# EAGLE design BPMLabMainDriver (EAGLE 7.5.0)
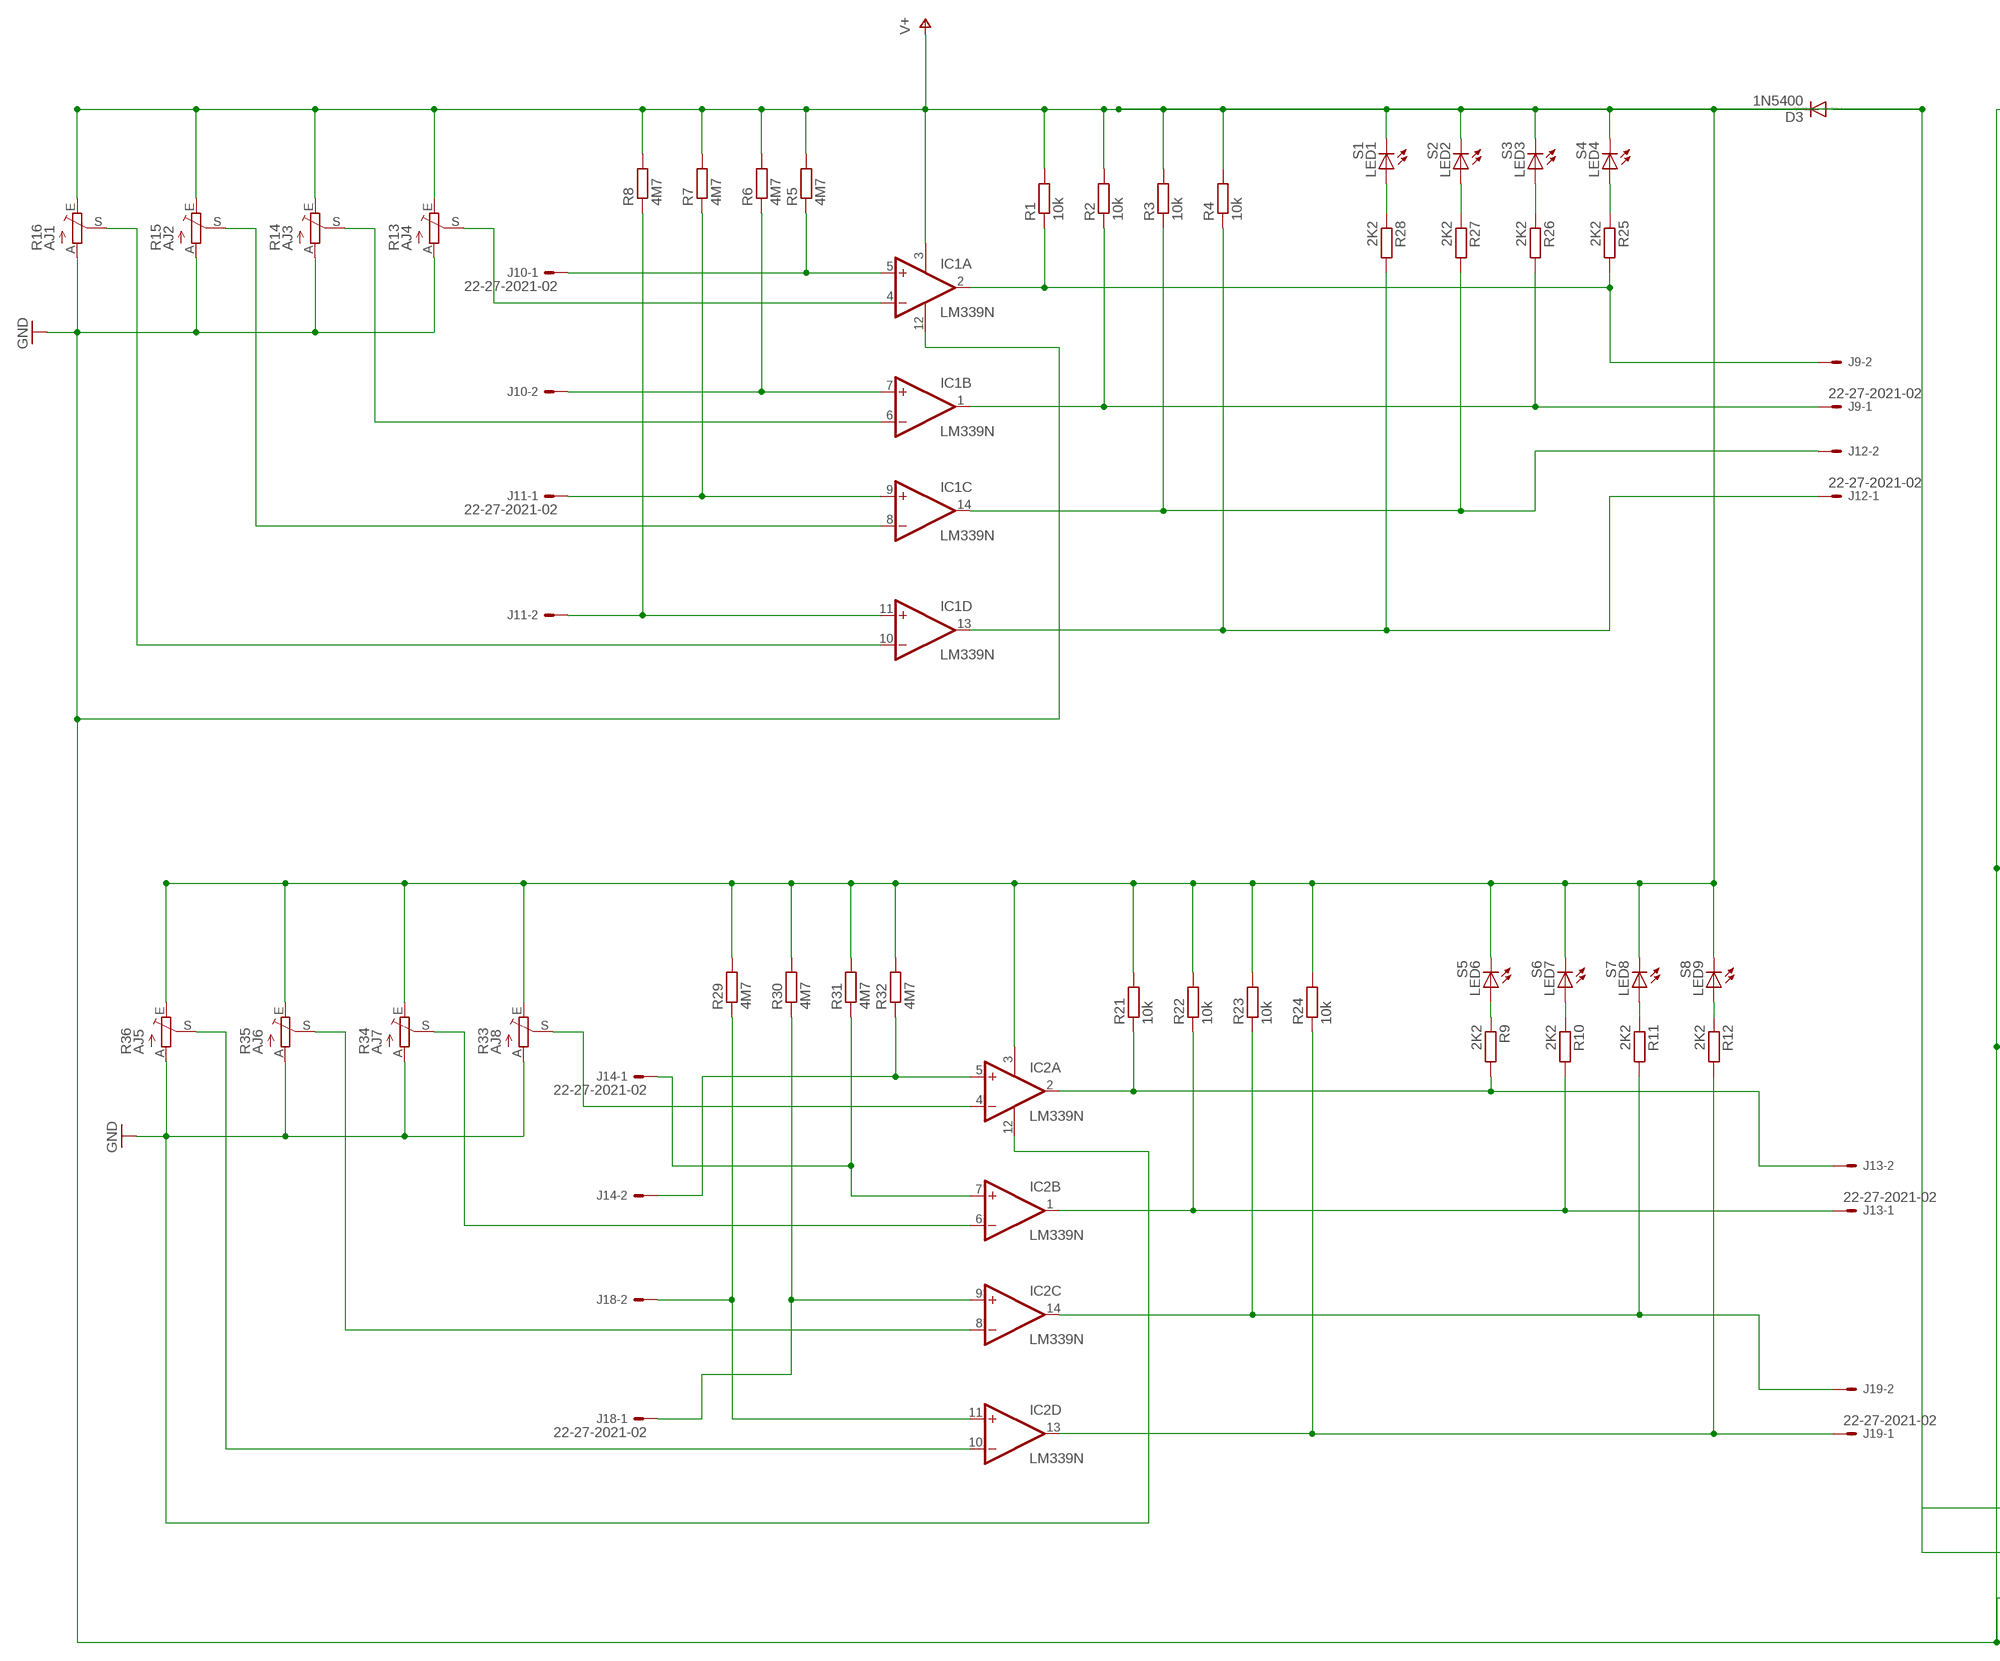
[diagram p0: schematic, sheet 1, part 1 of 2]
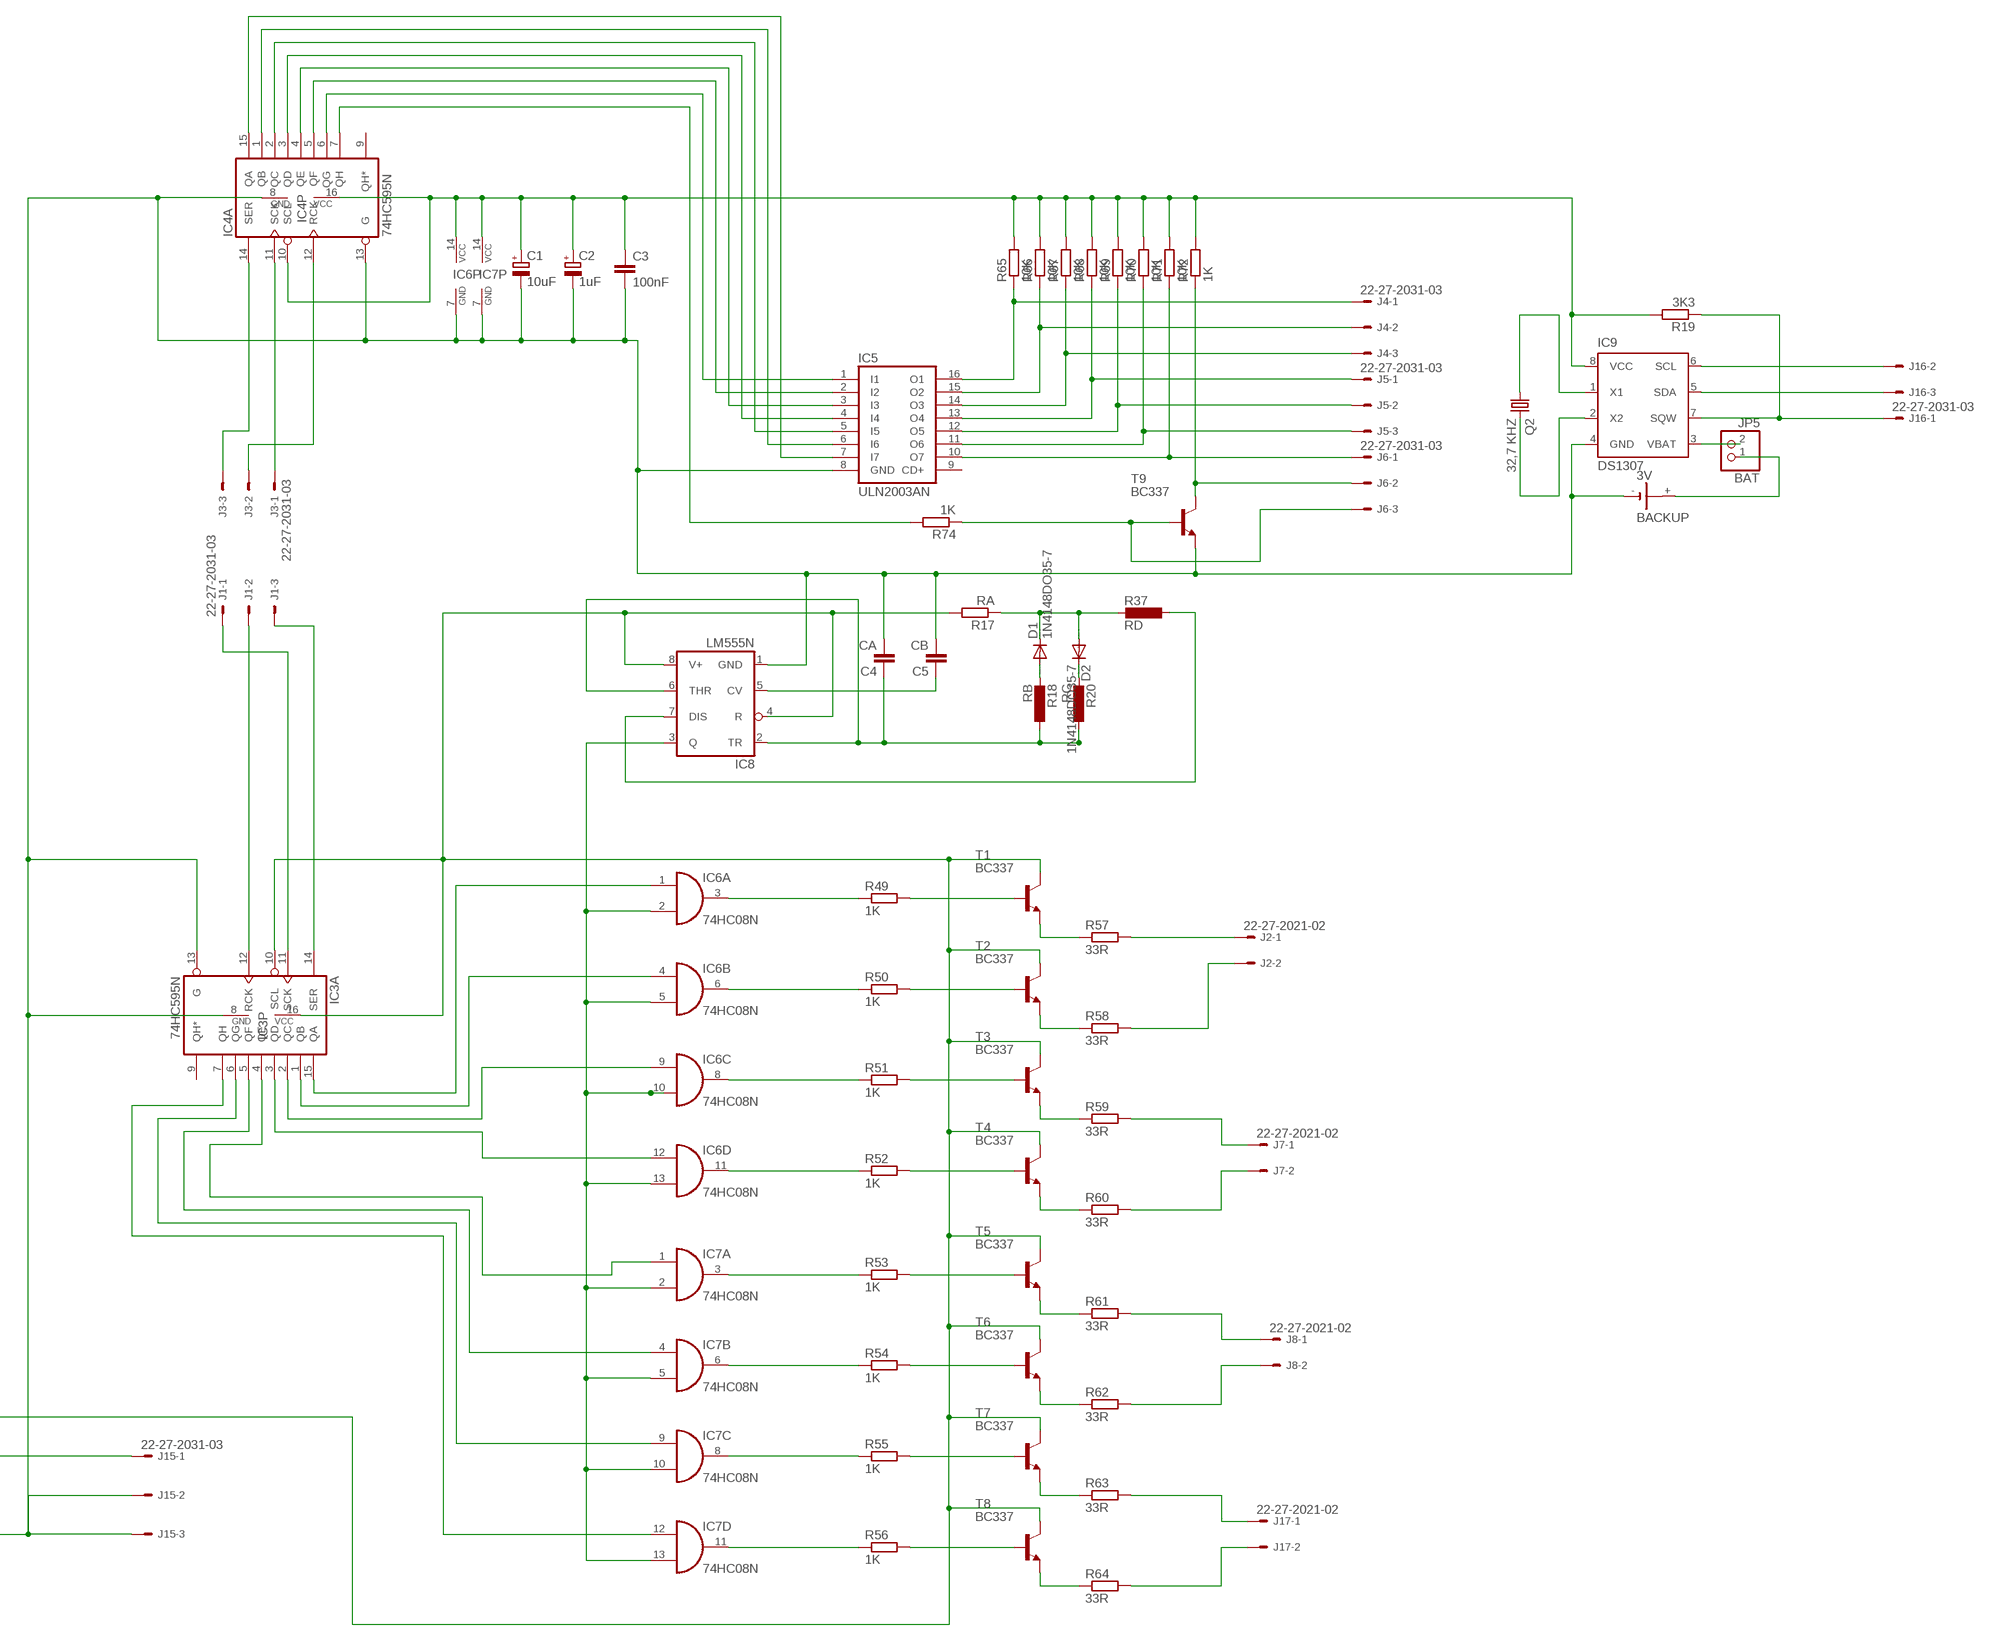
[diagram p1: schematic, sheet 1, part 2 of 2]

## Parts
3V  BACKUP  CR2032V  [CR2032V]
BAT  JP5  PINHD-1X2  [1X02]
C1  10uF  CPOL-EUE2.5-6  [E2,5-6]
C2  1uF  CPOL-EUE2.5-6  [E2,5-6]
C3  100nF  C-EU050-024X044  [C050-024X044]
C4  CA  C-EU050-025X075  [C050-025X075]
C5  CB  C-EU050-024X044  [C050-024X044]
D1  1N4148DO35-7  [DO35-7]
D2  1N4148DO35-7  [DO35-7]
D3  1N5400  [DO201-15]
IC1  LM339N  [DIL14]
IC2  LM339N  [DIL14]
IC3  74HC595N  [DIL16]
IC4  74HC595N  [DIL16]
IC5  ULN2003AN  [DIL16]
IC6  74HC08N  [DIL14]
IC7  74HC08N  [DIL14]
IC8  LM555N  [DIL08]
IC9  DS1307  [DIL08]
J1  22-27-2031-03  [6410-03]
J2  22-27-2021-02  [6410-02]
J3  22-27-2031-03  [6410-03]
J4  22-27-2031-03  [6410-03]
J5  22-27-2031-03  [6410-03]
J6  22-27-2031-03  [6410-03]
J7  22-27-2021-02  [6410-02]
J8  22-27-2021-02  [6410-02]
J9  22-27-2021-02  [6410-02]
J10  22-27-2021-02  [6410-02]
J11  22-27-2021-02  [6410-02]
J12  22-27-2021-02  [6410-02]
J13  22-27-2021-02  [6410-02]
J14  22-27-2021-02  [6410-02]
J15  22-27-2031-03  [6410-03]
J16  22-27-2031-03  [6410-03]
J17  22-27-2021-02  [6410-02]
J18  22-27-2021-02  [6410-02]
J19  22-27-2021-02  [6410-02]
LED1  S1  LED5MM  [LED5MM]
LED2  S2  LED5MM  [LED5MM]
LED3  S3  LED5MM  [LED5MM]
LED4  S4  LED5MM  [LED5MM]
LED6  S5  LED5MM  [LED5MM]
LED7  S6  LED5MM  [LED5MM]
LED8  S7  LED5MM  [LED5MM]
LED9  S8  LED5MM  [LED5MM]
Q2  32,7 KHZ  CRYSTALTC38H  [TC38H]
R1  10k  R-EU_0207/7  [0207/7]
R2  10k  R-EU_0207/7  [0207/7]
R3  10k  R-EU_0207/7  [0207/7]
R4  10k  R-EU_0207/7  [0207/7]
R5  4M7  R-EU_0207/10  [0207/10]
R6  4M7  R-EU_0207/10  [0207/10]
R7  4M7  R-EU_0207/10  [0207/10]
R8  4M7  R-EU_0207/10  [0207/10]
R9  2K2  R-EU_0207/7  [0207/7]
R10  2K2  R-EU_0207/7  [0207/7]
R11  2K2  R-EU_0207/7  [0207/7]
R12  2K2  R-EU_0207/7  [0207/7]
R13  AJ4  TRIM_EU-RS3  [RS3]
R14  AJ3  TRIM_EU-RS3  [RS3]
R15  AJ2  TRIM_EU-RS3  [RS3]
R16  AJ1  TRIM_EU-RS3  [RS3]
R17  RA  R-EU_0207/10  [0207/10]
R18  RB  L-EU0207/12  [0207/12]
R19  3K3  R-EU_0207/10  [0207/10]
R20  RC  L-EU0207/12  [0207/12]
R21  10k  R-EU_0207/7  [0207/7]
R22  10k  R-EU_0207/7  [0207/7]
R23  10k  R-EU_0207/7  [0207/7]
R24  10k  R-EU_0207/7  [0207/7]
R25  2K2  R-EU_0207/7  [0207/7]
R26  2K2  R-EU_0207/7  [0207/7]
R27  2K2  R-EU_0207/7  [0207/7]
R28  2K2  R-EU_0207/7  [0207/7]
R29  4M7  R-EU_0207/7  [0207/7]
R30  4M7  R-EU_0207/10  [0207/10]
R31  4M7  R-EU_0207/10  [0207/10]
R32  4M7  R-EU_0207/10  [0207/10]
R33  AJ8  TRIM_EU-RS3  [RS3]
R34  AJ7  TRIM_EU-RS3  [RS3]
R35  AJ6  TRIM_EU-RS3  [RS3]
R36  AJ5  TRIM_EU-RS3  [RS3]
R37  RD  L-EU0207/12  [0207/12]
R49  1K  R-EU_0207/10  [0207/10]
R50  1K  R-EU_0207/10  [0207/10]
R51  1K  R-EU_0207/10  [0207/10]
R52  1K  R-EU_0207/10  [0207/10]
R53  1K  R-EU_0207/10  [0207/10]
R54  1K  R-EU_0207/10  [0207/10]
R55  1K  R-EU_0207/10  [0207/10]
R56  1K  R-EU_0207/12  [0207/12]
R57  33R  R-EU_0207/10  [0207/10]
R58  33R  R-EU_0207/10  [0207/10]
R59  33R  R-EU_0207/10  [0207/10]
R60  33R  R-EU_0207/10  [0207/10]
R61  33R  R-EU_0207/10  [0207/10]
R62  33R  R-EU_0207/10  [0207/10]
R63  33R  R-EU_0207/10  [0207/10]
R64  33R  R-EU_0207/10  [0207/10]
R65  10K  R-EU_0207/10  [0207/10]
R66  10K  R-EU_0207/10  [0207/10]
R67  10K  R-EU_0207/10  [0207/10]
R68  10K  R-EU_0207/10  [0207/10]
R69  10K  R-EU_0207/10  [0207/10]
R70  10K  R-EU_0207/10  [0207/10]
R71  10K  R-EU_0207/10  [0207/10]
R72  1K  R-EU_0207/10  [0207/10]
R74  1K  R-EU_0207/10  [0207/10]
T1  BC337  [TO92]
T2  BC337  [TO92]
T3  BC337  [TO92]
T4  BC337  [TO92]
T5  BC337  [TO92]
T6  BC337  [TO92]
T7  BC337  [TO92]
T8  BC337  [TO92]
T9  BC337  [TO92]

## Nets
GND: 3V.- C1.- C2.- C3.2 C4.2 C5.2 IC1.12(P:GND) IC2.12(P:GND) IC3.8(P:GND) IC3.13(A:G) IC4.8(P:GND) IC4.13(A:G) IC5.8(GND) IC6.7(P:GND) IC7.7(P:GND) IC8.1(GND) IC9.4(GND) J15.2 J15.3 R13.A R14.A R15.A R16.A R33.A R34.A R35.A R36.A T9.1(E)
N$1: IC1.2(A:OUT) J9.2 R1.1 R25.2
N$2: IC1.1(B:OUT) J9.1 R2.1 R26.2
N$3: IC1.14(C:OUT) J12.2 R3.1 R27.2
N$4: IC1.13(D:OUT) J12.1 R4.1 R28.2
N$5: IC1.5(A:+IN) J10.1 R5.1
N$6: IC1.7(B:+IN) J10.2 R6.1
N$7: IC1.9(C:+IN) J11.1 R7.1
N$8: IC1.11(D:+IN) J11.2 R8.1
N$9: IC5.16(O1) J4.1 R65.1
N$10: IC1.10(D:-IN) R16.S
N$11: IC1.8(C:-IN) R15.S
N$12: IC1.4(A:-IN) R13.S
N$13: IC1.6(B:-IN) R14.S
N$14: IC6.2(A:I1) IC6.5(B:I1) IC6.10(C:I1) IC6.13(D:I1) IC7.2(A:I1) IC7.5(B:I1) IC7.10(C:I1) IC7.13(D:I1) IC8.3(Q)
N$15: D1.A R18.2
N$16: D2.C R20.2
N$17: LED6.A R9.1
N$18: LED7.A R10.1
N$19: LED8.A R11.1
N$20: LED9.A R12.1
N$21: IC3.1(A:QB) IC6.4(B:I0)
N$22: D1.C D2.A R17.1 R37.2
N$23: C5.1 IC8.5(CV)
N$24: IC8.7(DIS) R37.1
N$25: IC2.2(A:OUT) J13.2 R9.2 R21.1
N$26: 3V.+ BAT.1
N$27: IC2.1(B:OUT) J13.1 R10.2 R22.1
N$28: LED1.A R28.1
N$29: LED2.A R27.1
N$30: LED3.A R26.1
N$31: LED4.A R25.1
N$32: IC2.14(C:OUT) J19.2 R11.2 R23.1
N$33: IC2.13(D:OUT) J19.1 R12.2 R24.1
N$34: IC2.10(D:-IN) R36.S
N$35: IC2.8(C:-IN) R35.S
N$36: IC2.4(A:-IN) R33.S
N$37: IC2.6(B:-IN) R34.S
N$38: IC2.5(A:+IN) J14.2 R32.1
N$39: IC2.7(B:+IN) J14.1 R31.1
N$40: IC2.9(C:+IN) J18.1 R30.1
N$41: IC2.11(D:+IN) J18.2 R29.1
N$42: IC9.6(SCL) J16.2
N$43: IC9.5(SDA) J16.3
N$44: IC3.2(A:QC) IC6.9(C:I0)
N$45: IC3.3(A:QD) IC6.12(D:I0)
N$46: IC3.4(A:QE) IC7.1(A:I0)
N$47: IC3.5(A:QF) IC7.4(B:I0)
N$48: IC3.6(A:QG) IC7.9(C:I0)
N$49: IC3.7(A:QH) IC7.12(D:I0)
N$50: IC6.3(A:O) R49.1
N$51: IC6.6(B:O) R50.1
N$52: IC6.8(C:O) R51.1
N$53: IC3.15(A:QA) IC6.1(A:I0)
N$54: IC6.11(D:O) R52.1
N$55: IC7.3(A:O) R53.1
N$56: IC7.6(B:O) R54.1
N$57: IC7.8(C:O) R55.1
N$58: IC7.11(D:O) R56.1
N$59: C4.1 IC8.2(TR) IC8.6(THR) R18.1 R20.1
N$60: J17.2 R64.2
N$61: R49.2 T1.2(B)
N$62: R50.2 T2.2(B)
N$63: R51.2 T3.2(B)
N$64: R52.2 T4.2(B)
N$65: R53.2 T5.2(B)
N$66: R54.2 T6.2(B)
N$67: R56.2 T8.2(B)
N$68: R55.2 T7.2(B)
N$69: R57.1 T1.1(E)
N$70: R58.1 T2.1(E)
N$71: R59.1 T3.1(E)
N$72: R60.1 T4.1(E)
N$73: R61.1 T5.1(E)
N$74: R62.1 T6.1(E)
N$75: R63.1 T7.1(E)
N$76: R64.1 T8.1(E)
N$77: J8.1 R61.2
N$78: IC3.11(A:SCK) J1.1
N$79: IC3.12(A:RCK) J1.2
N$80: IC3.14(A:SER) J1.3
N$81: J8.2 R62.2
N$82: J17.1 R63.2
N$83: J7.2 R60.2
N$84: J7.1 R59.2
N$85: J2.2 R58.2
N$86: J2.1 R57.2
N$88: IC4.15(A:QA) IC5.7(I7)
N$89: IC4.1(A:QB) IC5.6(I6)
N$90: IC4.2(A:QC) IC5.5(I5)
N$91: IC4.3(A:QD) IC5.4(I4)
N$92: IC4.4(A:QE) IC5.3(I3)
N$93: IC4.5(A:QF) IC5.2(I2)
N$94: IC4.6(A:QG) IC5.1(I1)
N$95: IC5.15(O2) J4.2 R66.1
N$96: IC5.14(O3) J4.3 R67.1
N$97: IC4.11(A:SCK) J3.1
N$98: IC4.12(A:RCK) J3.2
N$99: IC4.14(A:SER) J3.3
N$100: IC5.13(O4) J5.1 R68.1
N$101: D3.A J15.1
N$102: IC5.12(O5) J5.2 R69.1
N$103: IC5.11(O6) J5.3 R70.1
N$104: IC5.10(O7) J6.1 R71.1
N$105: J6.2 R72.1 T9.3(C)
N$106: J6.3 R74.1 T9.2(B)
N$107: IC4.7(A:QH) R74.2
N$108: IC9.7(SQW) J16.1 R19.1
N$109: IC9.1(X1) Q2.1
N$110: IC9.2(X2) Q2.2
N$111: BAT.2 IC9.3(VBAT)
VCC: C1.+ C2.+ C3.1 D3.C IC1.3(P:V+) IC2.3(P:V+) IC3.10(A:SCL) IC3.16(P:VCC) IC4.10(A:SCL) IC4.16(P:VCC) IC6.14(P:VCC) IC7.14(P:VCC) IC8.4(R) IC8.8(V+) IC9.8(VCC) LED1.K(C) LED2.K(C) LED3.K(C) LED4.K(C) LED6.K(C) LED7.K(C) LED8.K(C) LED9.K(C) R1.2 R2.2 R3.2 R4.2 R5.2 R6.2 R7.2 R8.2 R13.E R14.E R15.E R16.E R17.2 R19.2 R21.2 R22.2 R23.2 R24.2 R29.2 R30.2 R31.2 R32.2 R33.E R34.E R35.E R36.E R65.2 R66.2 R67.2 R68.2 R69.2 R70.2 R71.2 R72.2 T1.3(C) T2.3(C) T3.3(C) T4.3(C) T5.3(C) T6.3(C) T7.3(C) T8.3(C) ; supply symbol labelled V+
Unconnected: 3V.+@1(+) IC3.9(A:QH*) IC4.9(A:QH*) IC5.9(CD+)

## Library data of the parts
3V = battery:CR2032V: LI BATTERY Varta
BAT = pinhead:PINHD-1X2: PIN HEADER
C1 C2 = rcl:CPOL-EU: POLARIZED CAPACITOR, European symbol
C3-C5 = resistor:C-EU: CAPACITOR, European symbol
D1 D2 = diode:1N4148: DIODE high speed (Philips)
D3 = diode:1N5400: DIODE standard rectifier, 3 A, 50 V (Motorola)
IC1 IC2 = linear:LM339: Low Power Low Offset Voltage Quad Comparators with open collector; LM139/LM239/LM339/LM2901/LM3302
IC3 IC4 = 74xx-eu:74*595: 8-bit SHIFT REGISTER, output latch
IC5 = uln-udn:ULN2003A: DRIVER ARRAY
IC6 IC7 = 74xx-eu:74*08: Quad 2-input AND gate
IC8 = linear:*555: TIMER
IC9 = ds1307_pcf8583:DS1307: I2C-Bus CLOCK/CALENDAR
J1 J3-J6 J15 J16 = con-molex:22-?-03: CONNECTOR wire to board 2.54 mm (.1 inch) pitch header; OC_FARNELL: unknown; OC_NEWARK: unknown
J2 J7-J14 J17-J19 = con-molex:22-?-02: CONNECTOR wire to board 2.54 mm (.1 inch) pitch header; OC_FARNELL: unknown; OC_NEWARK: unknown
LED1-LED4 LED6-LED9 = led:LED: LED OSRAM: - CHIPLED LG R971, LG N971, LY N971, LG Q971, LY Q971, LO R971, LY R971 LH N974, LH R974 LS Q976, LO Q976, LY Q976 LO Q996 - Hyper CHIPLED LW Q18S LB Q993, LB Q99A, LB R99A - SideLED LS A670, LO A670, LY A670, LG A670, LP A670 LB A673, LV A673, LT A673, LW A673 LH A674 LY A675 LS A676, LA A676, LO A676, LY A676, LW A676 LS A679, LY A679, LG A679 - Hyper Micro SIDELED® LS Y876, LA Y876, LO Y876, LY Y876 LT Y87S - SmartLED LW L88C, LW L88S LB L89C, LB L89S, LG L890 LS L89K, LO L89K, LY L89K LS L896, LA L896, LO L896, LY L896 - TOPLED LS T670, LO T670, LY T670, LG T670, LP T670 LSG T670, LSP T670, LSY T670, LOP T670, LYG T670 LG T671, LOG T671, LSG T671 LB T673, LV T673, LT T673, LW T673 LH T674 LS T676, LA T676, LO T676, LY T676, LB T676, LH T676, LSB T676, LW T676 LB T67C, LV T67C, LT T67C, LS T67K, LO T67K, LY T67K, LW E67C LS E67B, LA E67B, LO E67B, LY E67B, LB E67C, LV E67C, LT E67C LW T67C LS T679, LY T679, LG T679 LS T770, LO T770, LY T770, LG T770, LP T770 LB T773, LV T773, LT T773, LW T773 LH T774 LS E675, LA E675, LY E675, LS T675 LS T776, LA T776, LO T776, LY T776, LB T776 LHGB T686 LT T68C, LB T68C - Hyper Mini TOPLED® LB M676 - Mini TOPLED Santana® LG M470 LS M47K, LO M47K, LY M47K Source: http://www.osram.convergy.de LUXEON: - LUMILED® LXK2-PW12-R00, LXK2-PW12-S00, LXK2-PW14-U00, LXK2-PW14-V00 LXK2-PM12-R00, LXK2-PM12-S00, LXK2-PM14-U00 LXK2-PE12-Q00, LXK2-PE12-R00, LXK2-PE12-S00, LXK2-PE14-T00, LXK2-PE14-U00 LXK2-PB12-K00, LXK2-PB12-L00, LXK2-PB12-M00, LXK2-PB14-N00, LXK2-PB14-P00, LXK2-PB14-Q00 LXK2-PR12-L00, LXK2-PR12-M00, LXK2-PR14-Q00, LXK2-PR14-R00 LXK2-PD12-Q00, LXK2-PD12-R00, LXK2-PD12-S00 LXK2-PH12-R00, LXK2-PH12-S00 LXK2-PL12-P00, LXK2-PL12-Q00, LXK2-PL12-R00 Source: www.luxeon.com KINGBRIGHT: KA-3528ASYC Source: www.kingbright.com
Q2 = crystal:CRYSTAL: CRYSTAL; OC_FARNELL: unknown; OC_NEWARK: unknown
R1-R12 R17 R19 R21-R32 R49-R72 R74 = resistor:R-EU_: RESISTOR, European symbol
R13-R16 R33-R36 = pot:TRIM_EU-: POTENTIOMETER
R18 R20 R37 = resistor:L-EU: INDUCTOR, European symbol
T1-T9 = transistor:BC337: NPN TRANSISTOR

## Board
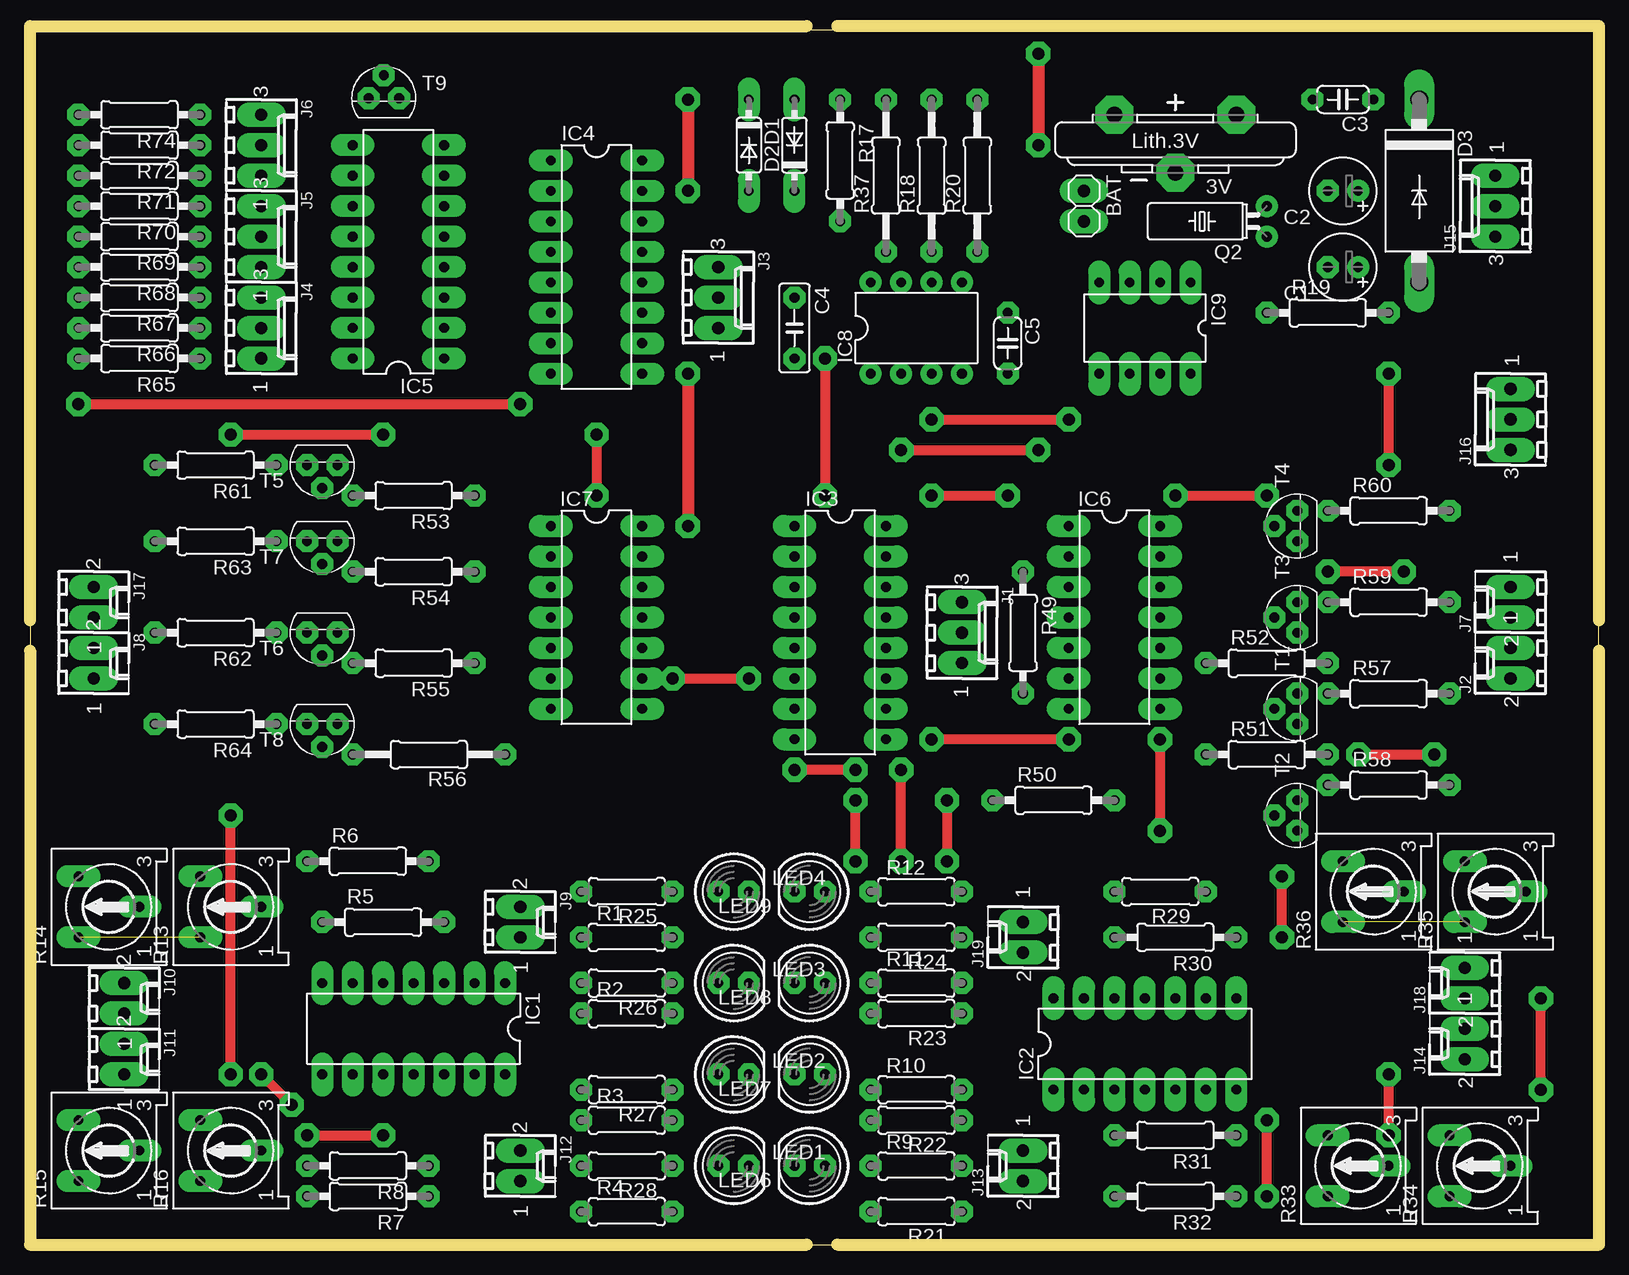
[diagram p2: board, top side]
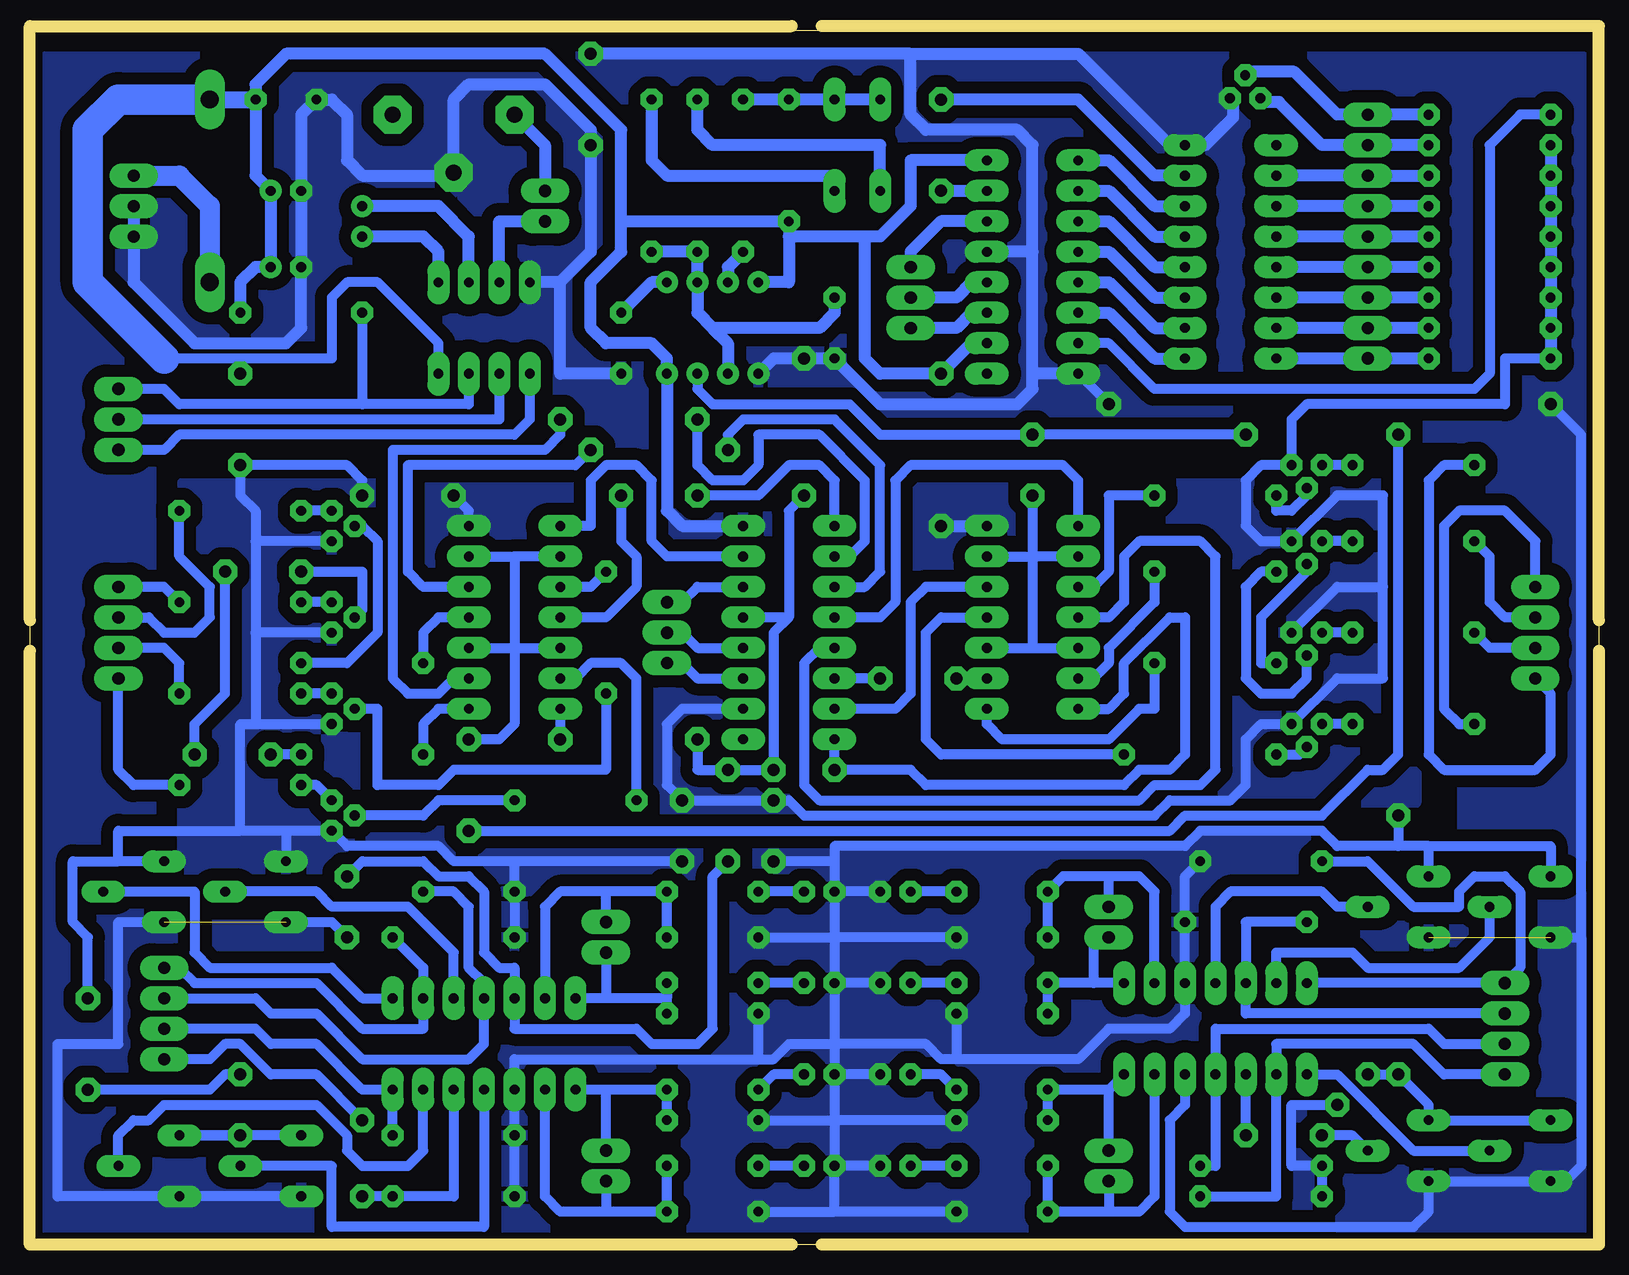
[diagram p3: board, bottom side, seen from below]

Size 130.79 x 101.27 mm. Coordinates in mm from the lower left corner, seen from the top.
Outline: 0,0 130.79,0 130.79,101.27 0,101.27 0,0
Copper layers (1*16): Top 0.035mm / dielectric 1.5mm / Bottom 0.035mm
Design rules "botpcb *": minimum track width 0.8mm, minimum drill 0.8mm, track to track 0.3mm, track to pad 0.3mm, pad to pad 0.3mm, via to via 0.3mm, smd to smd 8mil, copper to edge 40mil, drill to drill 8mil, minimum pad ring 20mil, minimum via ring 20mil, stop-mask expansion 0mil, vias tented up to drill 0mil, thermal gap 0mil
Milling: 8 lines

### Footprints (pad centres in the part's own frame; a part is rotated, then mirrored left to right if it is on the bottom)
CR2032V = drill 1.321 pad 3.15 octagon: + -2.54,-5.08; +@1 -2.54,5.08; - 2.286,0
1X02 = drill 1.016 long: 1 -1.27,0; 2 1.27,0
E2,5-6 = drill 0.813 pad 1.6: + -1.27,0 | drill 0.813 pad 1.6 octagon: - 1.27,0
C050-024X044 = drill 0.813 octagon: 1 -2.54,0; 2 2.54,0
C050-025X075 = drill 0.813 octagon: 1 -2.54,0; 2 2.54,0
DO35-7 = drill 0.813 long: A 3.81,0; C -3.81,0
DO201-15 = drill 1.499 long: A 7.62,0; C -7.62,0
DIL14 = drill 0.813 long: 1 -7.62,-3.81; 2 -5.08,-3.81; 3 -2.54,-3.81; 4 0,-3.81; 5 2.54,-3.81; 6 5.08,-3.81; 7 7.62,-3.81; 8 7.62,3.81; 9 5.08,3.81; 10 2.54,3.81; 11 0,3.81; 12 -2.54,3.81; 13 -5.08,3.81; 14 -7.62,3.81
DIL16 = drill 0.813 long: 1 -8.89,-3.81; 2 -6.35,-3.81; 3 -3.81,-3.81; 4 -1.27,-3.81; 5 1.27,-3.81; 6 3.81,-3.81; 7 6.35,-3.81; 8 8.89,-3.81; 9 8.89,3.81; 10 6.35,3.81; 11 3.81,3.81; 12 1.27,3.81; 13 -1.27,3.81; 14 -3.81,3.81; 15 -6.35,3.81; 16 -8.89,3.81
DIL08 = drill 0.813 pad 1.27: 1 -3.81,-3.81; 2 -1.27,-3.81; 3 1.27,-3.81; 4 3.81,-3.81; 5 3.81,3.81; 6 1.27,3.81; 7 -1.27,3.81; 8 -3.81,3.81
DIL08' = drill 0.813 long: 1 -3.81,-3.81; 2 -1.27,-3.81; 3 1.27,-3.81; 4 3.81,-3.81; 5 3.81,3.81; 6 1.27,3.81; 7 -1.27,3.81; 8 -3.81,3.81
6410-03 = drill 1.016 long: 1 2.54,0; 2 0,0; 3 -2.54,0
6410-02 = drill 1.016 long: 1 1.27,0; 2 -1.27,0
LED5MM = drill 0.813 octagon: A -1.27,0; K 1.27,0
TC38H = drill 0.813: 1 -1.27,0; 2 1.27,0
0207/7 = drill 0.813 octagon: 1 -3.81,0; 2 3.81,0
0207/10 = drill 0.813 octagon: 1 -5.08,0; 2 5.08,0
RS3 = drill 0.813 long: A -2.54,2.54; E 2.54,2.54; S 0,-2.54
0207/12 = drill 0.813 octagon: 1 -6.35,0; 2 6.35,0
TO92 = drill 0.813 octagon: 1 1.27,0; 2 0,1.905; 3 -1.27,0

### Placement (x,y rotation side)
3V  95.48,91.67 270 top
BAT  87.86,86.59 270 top
C1  109.45,81.51 180 top
C2  109.45,87.86 180 top
C3  109.45,95.48 180 top
C4  63.73,76.43 270 top
C5  81.51,75.16 270 top
D1  59.92,91.67 270 top
D2  63.73,91.67 90 top
D3  115.8,87.86 270 top
IC1  31.98,18.01 180 top
IC2  92.94,16.74 0 top
IC3  67.54,51.03 270 top
IC4  47.22,81.51 270 top
IC5  30.71,82.78 90 top
IC6  90.4,52.3 270 top
IC7  47.22,52.3 270 top
IC8  73.89,76.43 0 top
IC9  DS1307  [DIL08']  92.94,76.43 180 top
J1  77.7,51.03 270 top
J2  123.42,48.49 90 top
J3  57.38,78.97 270 top
J4  19.28,76.43 270 top
J5  19.28,84.05 270 top
J6  19.28,91.67 270 top
J7  123.42,53.57 90 top
J8  5.31,48.49 270 top
J9  40.87,26.9 270 top
J10  7.85,20.55 270 top
J11  7.85,15.47 270 top
J12  40.87,6.58 270 top
J13  82.78,6.58 90 top
J14  119.61,16.74 90 top
J15  122.15,86.59 90 top
J16  123.42,68.81 90 top
J17  5.31,53.57 270 top
J18  119.61,21.82 90 top
J19  82.78,25.63 90 top
LED1  58.65,6.58 0 top
LED2  58.65,14.2 0 top
LED3  58.65,21.82 0 top
LED4  58.65,29.44 0 top
LED6  65,6.58 180 top
LED7  65,14.2 180 top
LED8  65,21.82 180 top
LED9  65,29.44 180 top
Q2  103.1,85.32 90 top
R1  49.76,25.63 0 top
R2  49.76,19.28 0 top
R3  49.76,10.39 0 top
R4  49.76,2.77 0 top
R5  29.44,26.9 0 top
R6  28.17,31.98 0 top
R7  28.17,4.04 180 top
R8  28.17,6.58 180 top
R9  73.89,6.58 0 top
R10  73.89,12.93 0 top
R11  73.89,21.82 0 top
R12  73.89,29.44 0 top
R13  16.74,28.17 90 top
R14  6.58,28.17 90 top
R15  6.58,7.85 90 top
R16  16.74,7.85 90 top
R17  67.54,90.4 270 top
R18  75.16,89.13 90 top
R19  108.18,77.7 0 top
R20  78.97,89.13 90 top
R21  73.89,2.77 180 top
R22  73.89,10.39 180 top
R23  73.89,19.28 180 top
R24  73.89,25.63 180 top
R25  49.76,29.44 180 top
R26  49.76,21.82 180 top
R27  49.76,12.93 180 top
R28  49.76,6.58 180 top
R29  94.21,29.44 180 top
R30  95.48,25.63 180 top
R31  95.48,9.12 180 top
R32  95.48,4.04 180 top
R33  110.72,6.58 90 top
R34  120.88,6.58 90 top
R35  122.15,29.44 90 top
R36  111.99,29.44 90 top
R37  71.35,89.13 90 top
R49  82.78,51.03 270 top
R50  85.32,37.06 0 top
R51  103.1,40.87 0 top
R52  103.1,48.49 0 top
R53  31.98,62.46 180 top
R54  31.98,56.11 180 top
R55  31.98,48.49 180 top
R56  33.25,40.87 180 top
R57  113.26,45.95 0 top
R58  113.26,38.33 0 top
R59  113.26,53.57 0 top
R60  113.26,61.19 0 top
R61  15.47,65 180 top
R62  15.47,51.03 180 top
R63  15.47,58.65 180 top
R64  15.47,43.41 180 top
R65  9.12,73.89 180 top
R66  9.12,76.43 180 top
R67  9.12,78.97 180 top
R68  9.12,81.51 180 top
R69  9.12,84.05 180 top
R70  9.12,86.59 180 top
R71  9.12,89.13 180 top
R72  9.12,91.67 180 top
R74  9.12,94.21 180 top
T1  105.64,44.68 90 top
T2  105.64,35.79 90 top
T3  105.64,52.3 90 top
T4  105.64,59.92 90 top
T5  24.36,65 180 top
T6  24.36,51.03 180 top
T7  24.36,58.65 180 top
T8  24.36,43.41 180 top
T9  29.49,95.59 0 top

### Tracks (layer width: path | path; a pad name or v marks a point on that pad's centre or on a via)
GND  (via drill 1)  (2 unrouted)
  Top 0.813: v68.81,39.6 v63.73,39.6 | v86.59,42.14 v75.16,42.14 | v66.27,73.89 v66.27,62.46 | v72.62,31.98 v72.62,39.6 | v4.04,70.08 v40.87,70.08 | v104.37,25.63 v104.37,30.71
  Top 1.016: v84.05,99.29 v84.05,91.67
  Bottom 0.813: IC7.7 40.87,44.68 39.6,45.95 39.6,48.49 35.79,52.3 34.52,52.3 34.52,40.87 35.79,39.6 38.33,39.6 39.6,38.33 56.11,38.33 57.38,39.6 v63.73,39.6 IC3.8 | 67.54,52.3 68.81,51.03 v68.81,39.6 v72.62,39.6 75.16,39.6 v75.16,42.14 | IC6.7 v86.59,42.14 | v66.27,62.46 67.54,61.19 67.54,52.3 | 67.54,52.3 IC3.13 | v72.62,31.98 73.89,30.71 73.89,18.01 75.16,16.74 78.97,16.74 80.24,18.01 90.4,18.01 IC2.12 90.4,23.09 91.67,23.09 92.94,24.36 92.94,29.44 94.21,30.71 96.75,30.71 98.02,31.98 103.1,31.98 v104.37,30.71 | R33.A R34.A 128.5,4.04 128.5,16.74 123.42,16.74 123.42,26.9 R35.A | 1.5,25.63 1.5,67.54 v4.04,70.08 | v40.87,70.08 IC4.8 | R14.A 1.5,25.63 | 1.5,25.63 1.5,6.58 2.77,5.31 R15.A R16.A 14.2,2.77 15.47,1.5 34.52,1.5 35.79,2.77 35.79,10.39 34.52,11.66 IC1.12 | R36.A 105.64,26.9 v104.37,25.63
  Bottom 1.016: 86.59,80.24 84.05,82.78 v84.05,91.67 84.05,92.94 87.86,96.75 94.21,96.75 95.48,95.48 3V.- 95.48,89.13 103.1,89.13 104.37,90.4 104.37,94.21 105.64,95.48 C3.2 108.18,94.21 C2.- C1.- 108.18,76.43 109.45,75.16 117.07,75.16 122.15,80.24 J15.2 J15.3 | 86.59,80.24 IC9.4 | C5.2 86.59,72.62 86.59,80.24 | IC8.1 68.81,73.89 v66.27,73.89 C4.2 59.92,70.08 48.49,70.08 47.22,71.35 47.22,72.62 | IC4.8 47.22,72.62 | 47.22,72.62 47.22,82.78 | 47.22,82.78 IC4.13 | 47.22,82.78 47.22,91.67 48.49,92.94 56.11,92.94 57.38,94.21 57.38,99.29 | 57.38,99.29 43.41,99.29 35.79,91.67 IC5.8 32.79,91.67 30.48,93.98 30.48,95.31 T9.1 | 57.38,99.29 v84.05,99.29
  pour Bottom (isolate 1.016): 1.27,99.06 129.54,99.06 129.54,1.27 106.68,1.27 106.68,26.67 120.65,26.67 120.65,66.04 116.84,66.04 16.51,67.31 11.43,67.31 11.43,34.29 21.59,34.29 21.59,1.27 1.27,1.27
N$1
  Bottom 0.813: R1.1 R25.2 44.68,30.71 40.87,30.71 | IC1.2 37.06,29.44 38.33,30.71 40.87,30.71 | J9.2 40.87,30.71
N$2
  Bottom 0.813: R2.1 R26.2 42.14,21.82 | IC1.1 42.14,21.82 | J9.1 42.14,25.63 42.14,21.82
N$3
  Bottom 0.813: R3.1 R27.2 40.87,12.93 | J12.2 40.87,12.93 | 40.87,12.93 IC1.14
N$4
  Bottom 0.813: R28.2 R4.1 40.87,2.77 | IC1.13 37.06,4.04 38.33,2.77 40.87,2.77 | J12.1 40.87,2.77
N$5
  Bottom 0.813: R5.1 29.44,26.9 IC1.5 29.44,19.28 J10.1
N$6
  Bottom 0.813: IC1.7 J10.2 6.58,23.09 6.58,29.44 7.85,30.71 10.39,30.71 11.66,29.44 11.66,28.17 15.47,28.17 19.28,31.98 R6.1
N$7
  Bottom 0.813: J11.1 12.93,14.2 15.47,16.74 26.9,16.74 IC1.9 26.9,4.04 R7.1
N$8
  Bottom 0.813: J11.2 12.93,16.74 14.2,18.01 31.98,18.01 IC1.11 31.98,6.58 R8.1
N$9
  Bottom 1.016: R65.1 J4.1 IC5.16
N$10  (via drill 1)
  Top 0.813: v23.09,9.12 v29.44,9.12
  Bottom 0.813: R16.S 20.55,9.12 v23.09,9.12 | v29.44,9.12 IC1.10
N$11
  Bottom 0.813: IC1.8 21.82,14.2 15.47,7.85 R15.S
N$12
  Bottom 0.813: R13.S 21.82,28.17 23.09,29.44 30.71,29.44 31.98,28.17 IC1.4
N$13
  Bottom 0.813: IC1.6 26.9,24.36 20.55,24.36 19.28,23.09 11.66,23.09 9.12,25.63 R14.S
N$14  (via drill 1)
  Top 0.813: v47.22,67.54 v47.22,62.46 | v94.21,42.14 v94.21,34.52 | v16.74,67.54 v29.44,67.54
  Bottom 0.813: IC7.13 47.22,57.38 | IC7.2 47.22,57.38 | 47.22,57.38 47.22,49.76 | 47.22,49.76 IC7.5 | IC7.10 47.22,49.76 | IC6.13 90.4,57.38 | 90.4,57.38 90.4,49.76 | IC6.10 90.4,49.76 | 90.4,49.76 IC6.5 | IC8.3 75.16,71.35 73.89,70.08 62.46,70.08 59.92,67.54 v47.22,67.54 v29.44,67.54 | v47.22,62.46 47.22,57.38 | IC6.2 90.4,57.38 | 90.4,49.76 90.4,43.41 91.67,42.14 v94.21,42.14 | v94.21,34.52 35.79,34.52 34.52,35.79 23.09,35.79 19.28,39.6 18.01,39.6 16.74,40.87 v16.74,67.54
N$15
  Bottom 1.016: D1.A 59.92,91.67 73.89,91.67 75.16,92.94 R18.2
N$16
  Bottom 1.016: R20.2 78.97,90.4 77.7,89.13 63.73,89.13 D2.C
N$17
  Bottom 0.813: LED6.A R9.1
N$18
  Bottom 0.813: LED7.A 68.81,14.2 R10.1
N$19
  Bottom 0.813: LED8.A R11.1
N$20
  Bottom 0.813: LED9.A R12.1
N$21  (via drill 1)
  Top 0.813: v75.16,62.46 v81.51,62.46
  Bottom 0.813: IC3.1 63.73,63.73 65,65 67.54,65 70.08,62.46 v75.16,62.46 | v81.51,62.46 81.51,58.65 80.24,57.38 80.24,54.84 82.78,52.3 IC6.4
N$22
  Bottom 1.016: D1.C D2.A R17.1 R37.2
N$23
  Bottom 1.016: IC8.5 78.97,80.24 C5.1
N$24
  Bottom 1.016: R37.1 72.62,81.51 IC8.7
N$25
  Bottom 0.813: 82.78,2.77 R21.1 R9.2 | 82.78,2.77 86.59,2.77 87.86,4.04 IC2.2 | J13.2 82.78,2.77
N$26
  Bottom 1.016: 3V.+ 87.86,91.67 BAT.1
N$27
  Bottom 0.813: R22.1 R10.2 82.78,12.93 | 82.78,12.93 IC2.1 | J13.1 82.78,12.93
N$28
  Bottom 0.813: R28.1 LED1.A
N$29
  Bottom 0.813: R27.1 54.84,14.2 LED2.A
N$30
  Bottom 0.813: R26.1 LED3.A
N$31
  Bottom 0.813: R25.1 LED4.A
N$32
  Bottom 0.813: R23.1 77.7,20.55 | R11.2 77.7,20.55 | 77.7,20.55 82.78,20.55 | 82.78,20.55 IC2.14 | J19.2 82.78,20.55
N$33
  Bottom 0.813: R24.1 R12.2 82.78,29.44 | 82.78,29.44 86.59,29.44 87.86,28.17 IC2.13 | J19.1 82.78,29.44
N$34
  Bottom 0.813: IC2.10 95.48,24.36 99.29,28.17 105.64,28.17 106.91,29.44 R36.S
N$35
  Bottom 0.813: R35.S 117.07,29.44 117.07,24.36 115.8,23.09 105.64,23.09 103.1,20.55 IC2.8
N$36
  Bottom 0.813: IC2.4 92.94,1.5 105.64,1.5 105.64,6.58 R33.S
N$37
  Bottom 0.813: R34.S 123.42,9.12 122.15,10.39 120.88,10.39 119.61,11.66 106.91,11.66 104.37,9.12 104.37,7.85 103.1,6.58 99.29,6.58 98.02,7.85 IC2.6
N$38  (via drill 1)
  Top 0.813: v103.1,4.04 v103.1,10.39
  Bottom 0.813: IC2.5 95.48,4.04 R32.1 v103.1,4.04 | v103.1,10.39 106.91,14.2 110.72,14.2 113.26,16.74 114.53,16.74 115.8,15.47 J14.2
N$39
  Bottom 0.813: J14.1 111.99,18.01 110.72,16.74 106.91,16.74 103.1,12.93 IC2.7 R31.1
N$40
  Bottom 0.813: R30.1 98.02,23.09 IC2.9 98.02,18.01 103.1,18.01 106.91,21.82 117.07,21.82 118.34,23.09 J18.1
N$41
  Bottom 0.813: R29.1 95.48,29.44 94.21,28.17 94.21,23.09 92.94,21.82 IC2.11 92.94,16.74 94.21,15.47 103.1,15.47 106.91,19.28 110.72,19.28 111.99,20.55 J18.2
N$42
  Bottom 0.813: IC9.6 91.67,68.81 J16.2
N$43
  Bottom 0.813: IC9.5 89.13,68.81 90.4,67.54 118.34,67.54 119.61,66.27 J16.3
N$44  (via drill 1)
  Top 0.813: v75.16,68.81 v86.59,68.81
  Bottom 0.813: IC3.2 62.46,57.38 61.19,58.65 61.19,63.73 65,67.54 70.08,67.54 70.08,65 71.35,63.73 73.89,63.73 75.16,65 v75.16,68.81 | v86.59,68.81 86.59,67.54 87.86,66.27 100.56,66.27 100.56,47.22 99.29,45.95 96.75,45.95 95.48,47.22 IC6.9
N$45  (via drill 1)
  Top 0.813: v72.62,66.27 v84.05,66.27
  Bottom 0.813: IC3.3 61.19,54.84 59.92,56.11 59.92,65 63.73,68.81 71.35,68.81 72.62,67.54 v72.62,66.27 | v84.05,66.27 85.32,65 99.29,65 99.29,56.11 98.02,54.84 IC6.12
N$46
  Bottom 0.813: IC7.1 43.41,63.73 44.68,65 57.38,65 58.65,63.73 58.65,53.57 59.92,52.3 IC3.4
N$47
  Bottom 0.813: IC3.5 65,49.76 66.27,48.49 66.27,38.33 65,37.06 38.33,37.06 37.06,38.33 33.25,38.33 31.98,39.6 31.98,57.38 33.25,58.65 38.33,58.65 39.6,57.38 39.6,53.57 40.87,52.3 IC7.4
N$48  (via drill 1)
  Top 0.813: v53.57,47.22 v59.92,47.22
  Bottom 0.813: IC7.9 v53.57,47.22 | v59.92,47.22 IC3.6
N$49
  Bottom 0.813: IC7.12 56.11,54.84 57.38,53.57 57.38,45.95 58.65,44.68 IC3.7
N$50
  Bottom 0.813: R49.1 84.05,54.84 IC6.3
N$51
  Bottom 0.813: R50.1 80.24,47.22 81.51,48.49 84.05,48.49 85.32,47.22 IC6.6
N$52
  Bottom 0.813: IC6.8 96.75,44.68 98.02,43.41 R51.1
N$53
  Bottom 0.813: IC3.15 77.7,57.38 78.97,58.65 78.97,63.73 80.24,65 82.78,65 84.05,63.73 84.05,59.92 IC6.1
N$54
  Bottom 0.813: IC6.11 96.75,52.3 98.02,51.03 R52.1
N$55
  Bottom 0.813: R53.1 40.87,62.46 40.87,56.11 42.14,54.84 IC7.3
N$56
  Bottom 0.813: R54.1 37.06,53.57 40.87,49.76 40.87,48.49 42.14,47.22 IC7.6
N$57
  Bottom 0.813: R55.1 37.06,44.68 38.33,44.68 40.87,42.14 49.76,42.14 51.03,43.41 IC7.8
N$58
  Bottom 0.813: R56.1 54.84,40.87 56.11,42.14 56.11,51.03 54.84,52.3 IC7.11
N$59
  Bottom 1.016: 73.89,76.43 75.16,77.7 IC8.6 R18.1 R20.1 | 73.89,76.43 72.62,75.16 IC8.2 | C4.1 63.73,77.7 65,76.43 73.89,76.43
N$60
  Bottom 0.813: J17.2 5.31,58.65 7.85,61.19 11.66,61.19 12.93,59.92 12.93,44.68 11.66,43.41 R64.2
N$61
  Bottom 0.813: R49.2 82.78,39.6 95.48,39.6 96.75,38.33 101.83,38.33 101.83,44.68 T1.2
N$62
  Bottom 0.813: R50.2 96.75,37.06 98.02,35.79 T2.2
N$63  (via drill 1)
  Top 0.813: v110.72,40.87 v117.07,40.87 | v114.53,56.11 v108.18,56.11
  Bottom 0.813: R51.2 v110.72,40.87 | v117.07,40.87 117.07,43.41 114.53,45.95 v114.53,56.11 | v108.18,56.11 103.1,56.11 103.1,52.93 T3.2
N$64
  Bottom 0.813: T4.2 103.1,59.92 101.83,58.65 101.83,51.03 104.37,48.49 R52.2
N$65
  Bottom 0.813: T5.2 24.36,62.46 25.63,61.19 26.9,61.19 R53.2
N$66
  Bottom 0.813: R54.2 28.17,56.11 29.44,54.84 29.44,47.22 28.17,45.95 25.63,45.95 24.36,47.22 T6.2
N$67
  Bottom 0.813: R56.2 24.99,40.87 T8.2
N$68
  Bottom 0.813: T7.2 24.36,56.11 28.17,52.3 28.17,48.49 R55.2
N$69
  Bottom 0.813: T1.1 R57.1
N$70
  Bottom 0.813: T2.1 106.91,38.33 R58.1
N$71
  Bottom 0.813: T3.1 R59.1
N$72
  Bottom 0.813: T4.1 R60.1
N$73
  Bottom 0.813: R61.1 T5.1
N$74
  Bottom 0.813: R62.1 T6.1
N$75
  Bottom 0.813: R63.1 T7.1
N$76
  Bottom 0.813: R64.1 T8.1
N$77
  Bottom 0.813: R61.2 12.93,65 14.2,63.73 14.2,40.87 12.93,39.6 5.31,39.6 4.04,40.87 4.04,45.95 J8.1
N$78
  Bottom 0.813: J1.1 76.43,48.49 75.16,47.22 IC3.11
N$79
  Bottom 0.813: J1.2 76.43,51.03 75.16,49.76 IC3.12
N$80
  Bottom 0.813: J1.3 76.43,53.57 75.16,54.84 IC3.14
N$81
  Bottom 0.813: J8.2 9.12,49.76 R62.2
N$82
  Bottom 0.813: J17.1 7.85,52.3 9.12,53.57 9.12,57.38 R63.2
N$83
  Bottom 0.813: J7.2 120.88,52.3 119.61,51.03 117.07,51.03 115.8,52.3 115.8,54.84 118.34,57.38 R60.2
N$84
  Bottom 0.813: R59.2 119.61,54.84 J7.1
N$85
  Bottom 0.813: R58.2 122.15,38.33 123.42,39.6 J2.2
N$86
  Bottom 0.813: R57.2 118.34,48.49 119.61,49.76 J2.1
N$88  (via drill 1)
  Top 1.016: v54.84,95.48 v54.84,87.86
  Bottom 1.016: IC5.7 37.06,89.13 43.41,95.48 v54.84,95.48 | v54.84,87.86 IC4.15
N$89
  Bottom 1.016: IC4.1 40.87,90.4 37.06,86.59 IC5.6
N$90
  Bottom 1.016: IC4.2 40.87,87.86 37.06,84.05 IC5.5
N$91
  Bottom 1.016: IC4.3 40.87,85.32 37.06,81.51 IC5.4
N$92
  Bottom 1.016: IC4.4 40.87,82.78 37.06,78.97 IC5.3
N$93
  Bottom 1.016: IC4.5 40.87,80.24 37.06,76.43 IC5.2
N$94
  Bottom 1.016: IC4.6 40.87,77.7 37.06,73.89 IC5.1
N$95
  Bottom 1.016: R66.1 J4.2 IC5.15
N$96
  Bottom 1.016: R67.1 J4.3 IC5.14
N$97
  Bottom 1.016: IC4.11 52.3,77.7 53.57,76.43 J3.1
N$98
  Bottom 1.016: IC4.12 52.3,80.24 53.57,78.97 J3.2
N$99
  Bottom 1.016: IC4.14 54.84,85.32 57.38,82.78 J3.3
N$100
  Bottom 1.016: R68.1 J5.1 IC5.13
N$101
  Bottom 1.676: J15.1 118.34,89.13 115.8,86.59 D3.A
N$102
  Bottom 1.016: R69.1 J5.2 IC5.12
N$103
  Bottom 1.016: R70.1 J5.3 IC5.11
N$104
  Bottom 1.016: IC5.10 J6.1 R71.1
N$105
  Bottom 1.016: R72.1 J6.2 23.09,91.67 26.67,95.25 27.88,95.25 T9.3
N$106
  Bottom 1.016: R74.1 J6.3 21.82,94.21 25.4,97.79 29.2,97.79 T9.2
N$107
  Bottom 0.813: R74.2 6.58,94.21 9.12,91.67 9.12,72.62 10.39,71.35 37.06,71.35 40.87,75.16 IC4.7
N$108
  Bottom 0.813: IC9.7 94.21,70.08 103.1,70.08 | R19.1 103.1,70.08 | 103.1,70.08 118.34,70.08 119.61,71.35 J16.1
N$109
  Bottom 1.016: IC9.1 96.75,82.78 98.02,84.05 Q2.1
N$110
  Bottom 1.016: IC9.2 94.21,84.05 96.75,86.59 Q2.2
N$111
  Bottom 1.016: IC9.3 91.67,85.32 BAT.2
VCC  (via drill 1)
  Top 0.813: v95.48,62.46 v103.1,62.46 | v113.26,65 v113.26,72.62 | v76.43,37.06 v76.43,31.98 | v68.81,31.98 v68.81,37.06 | v113.26,9.12 v113.26,14.2 | v125.96,12.93 v125.96,20.55 | v16.74,14.2 v16.74,35.79 | v21.82,11.66 v19.28,14.2
  Top 1.016: v54.84,72.62 v54.84,59.92
  Bottom 0.813: IC9.8 96.75,75.16 101.83,80.24 104.37,80.24 105.64,78.97 105.64,73.89 113.26,73.89 | 18.01,54.84 18.01,47.22 21.82,47.22 T8.3 28.17,43.41 29.44,42.14 29.44,38.33 30.71,37.06 35.79,37.06 37.06,35.79 66.27,35.79 67.54,37.06 v68.81,37.06 v76.43,37.06 77.7,38.33 77.7,43.41 76.43,44.68 IC3.10 | T6.3 21.82,54.84 18.01,54.84 | 18.01,54.84 18.01,62.46 21.82,62.46 T7.3 28.17,58.65 29.44,59.92 29.44,63.73 28.17,65 T5.3 25.63,68.81 24.36,70.08 7.85,70.08 7.85,73.89 R65.2 | 109.45,34.52 113.26,34.52 | 113.26,34.52 113.26,43.41 111.99,43.41 | 111.99,43.41 T1.3 | T4.3 111.99,58.65 | 111.99,58.65 111.99,51.03 | 111.99,51.03 111.99,43.41 | T3.3 111.99,51.03 | IC6.14 94.21,61.19 v95.48,62.46 | v103.1,62.46 103.1,63.73 104.37,65 v113.26,65 113.26,62.46 111.99,61.19 111.99,58.65 | v113.26,72.62 113.26,73.89 | v76.43,31.98 90.4,31.98 | 90.4,31.98 95.48,31.98 96.75,33.25 104.37,33.25 T2.3 109.45,34.52 | LED9.K 63.73,25.63 | 63.73,25.63 LED8.K | LED8.K 63.73,16.74 | 63.73,16.74 LED7.K | LED7.K 63.73,10.39 | 63.73,10.39 LED6.K | R24.2 63.73,25.63 | 70.08,15.47 68.81,15.47 67.54,16.74 63.73,16.74 | R22.2 63.73,10.39 | R21.2 63.73,2.77 | 63.73,2.77 LED6.K | 109.45,34.52 R36.E | R35.E 123.42,31.98 | 123.42,31.98 123.42,34.52 113.26,34.52 | 90.4,31.98 R29.2 R30.2 | R32.2 R31.2 IC2.3 90.4,15.47 70.08,15.47 | 70.08,15.47 R23.2 | 63.73,31.98 v68.81,31.98 | LED4.K LED9.K | LED3.K LED8.K | LED2.K LED7.K | LED1.K LED6.K | R3.2 63.73,10.39 | R4.2 63.73,2.77 | R1.2 63.73,25.63 | R2.2 53.57,15.47 | 53.57,15.47 54.84,15.47 56.11,16.74 63.73,16.74 | 53.57,15.47 43.41,15.47 40.87,18.01 35.79,18.01 34.52,19.28 IC1.3 R5.2 34.52,30.71 R6.2 | 16.74,33.25 21.82,33.25 23.09,34.52 33.25,34.52 34.52,33.25 63.73,33.25 63.73,31.98
  Bottom 0.813: 63.73,31.98 LED9.K | R13.E 14.2,33.25 | 14.2,33.25 16.74,33.25 | 14.2,33.25 4.04,33.25 R14.E | R7.2 R8.2 25.63,6.58 25.63,11.66 v21.82,11.66 | R15.E R16.E 14.2,11.66 v16.74,14.2 v19.28,14.2 | R33.E R34.E v113.26,9.12 | v113.26,14.2 114.53,14.2 115.8,12.93 v125.96,12.93 | v125.96,20.55 125.96,25.63 127.23,26.9 127.23,31.98 123.42,31.98 | v16.74,35.79 16.74,33.25 | 113.26,73.89 119.61,73.89
  Bottom 1.016: 67.54,84.05 R17.2 81.51,85.32 | 67.54,84.05 67.54,80.24 IC8.8 | 81.51,85.32 81.51,82.78 84.05,80.24 84.05,76.43 82.78,75.16 78.97,75.16 77.7,73.89 IC8.4 77.7,61.19 76.43,59.92 IC3.16 | 81.51,85.32 81.51,92.94 87.86,99.29 109.45,99.29 111.99,96.75 C3.1 111.99,89.13 C2.+ C1.+ 111.99,81.51 113.26,80.24 R19.2 | IC4.16 57.38,90.4 57.38,86.59 59.92,84.05 61.19,84.05 | 61.19,84.05 67.54,84.05 | IC4.10 52.3,75.16 v54.84,72.62 59.92,72.62 61.19,73.89 61.19,84.05 | R72.2 R71.2 R70.2 R69.2 R68.2 R67.2 R66.2 R65.2 | v54.84,59.92 IC7.14
  Bottom 1.422: D3.C C3.1
  Bottom 2.54: D3.C 123.42,95.48 125.96,92.94 125.96,80.24 119.61,73.89
  pour Bottom (isolate 1.016): 24.13,1.27 100.33,1.27 100.33,30.48 118.11,30.48 118.11,63.5 15.24,63.5 15.24,36.83 24.13,36.83